# Altium schematic sheet DriverCircuit.SchDoc
size A4
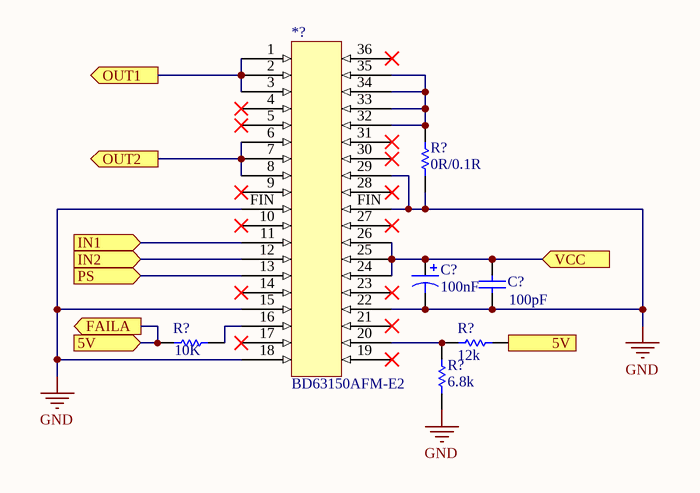
[diagram p0: DriverCircuit.SchDoc]

## Parts
(Parts that share a designator on the sheet are numbered #1, #2 ... from top to bottom, then left to right.)
*?  BD63150AFM-E2
C?#1  value 100nF  [Cap_0603_HD]  (hidden comment: Cap Pol1)
C?#2  value 100pF  [C0805]  (hidden comment: Cap)
R?#1  value 0R/0.1R  [0603]  (hidden comment: Res1)
R?#2  value 10K  [0603]  (hidden comment: Res1)
R?#3  value 6.8k  [0603]  (hidden comment: Res1)
R?#4  value 12k  [0603]  (hidden comment: Res1)

## Ports
5V (in), FAILA (out), IN1 (in), IN2 (in), OUT1 (out), OUT2 (out), PS (in), VCC (in)

## Nets
GND: *?.15 *?.18 *?.22 *?.29 *?.FIN C?#1.2 C?#2.1 R?#1.2 R?#3.2
5V: R?#2.1 R?#4.1 ; port 5V, port FAILA
IN1: *?.11 ; port IN1
IN2: *?.12 ; port IN2
OUT1: *?.1 *?.2 *?.3 ; port OUT1
OUT2: *?.6 *?.7 *?.8 ; port OUT2
PS: *?.13 ; port PS
VCC: *?.24 *?.25 *?.26 C?#1.1 C?#2.2 ; port VCC
Net*?_16: *?.16 R?#2.2
Net*?_20: *?.20 R?#3.1 R?#4.2
Net*?_32: *?.32 *?.33 *?.34 *?.35 R?#1.1

Not connected (* = marked no-connect by the designer): *? 4* 5* 9* 10* 14* 17* 19* 21* 23* 27* 28* 30* 31* 36*

## Library data of the parts
*? = BD63150AFM-E2: DC Driver
C?#1 = Cap Pol1: Polarized Capacitor (Radial); Published: 8-Jun-2000; LatestRevisionDate: 17-Jul-2002; LatestRevisionNote: Re-released for DXP Platform.; PackageReference: RB7.6-15; Publisher: Altium Limited; PackageDescription: Polarized Capacitor (Radial); 2 Leads
C?#2 = Cap: Capacitor; Published: 8-Jun-2000; LatestRevisionDate: 17-Jul-2002; LatestRevisionNote: Re-released for DXP Platform.; PackageReference: RAD-0.3; Publisher: Altium Limited; PackageDescription: Radial Cap, Thru-Hole; 2 Leads; 0.3 in Pin Spacing
R?#1-R?#4 = Res1: Resistor; Published: 8-Jun-2000; LatestRevisionDate: 17-Jul-2002; LatestRevisionNote: Re-released for DXP Platform.; PackageReference: AXIAL-0.3; Publisher: Altium Limited; PackageDescription: Axial Device, Thru-Hole; 2 Leads; 0.3 in Pin Spacing